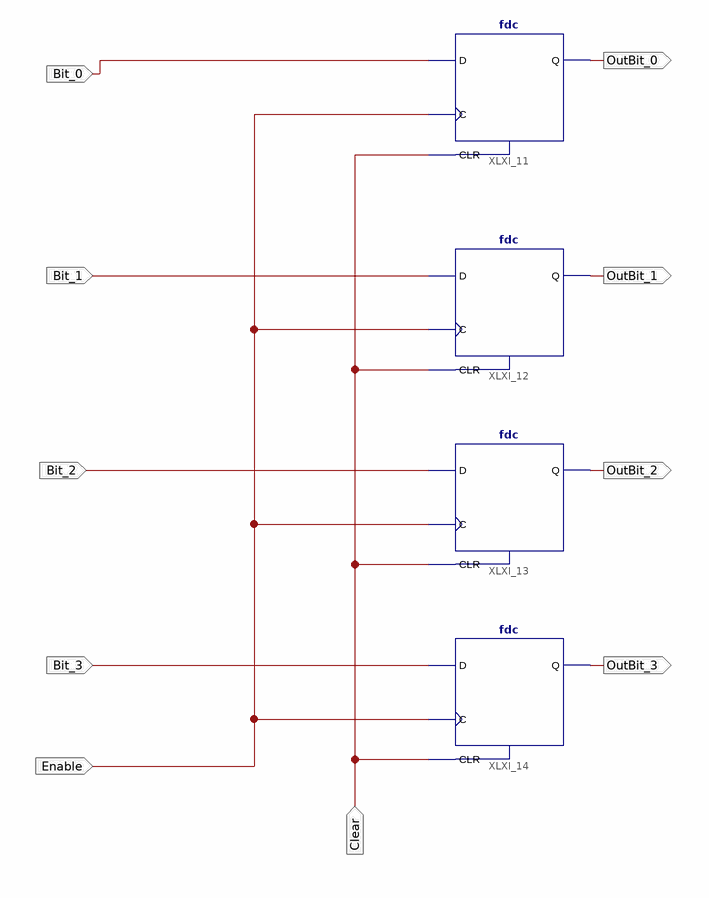
[diagram p0: schematic sheet 1]
// Xilinx ISE schematic FF_4bit.sch (spartan6) as structural Verilog: 4 symbols, 10 ports
module FF_4bit (
  input  Bit_0,
  input  Bit_1,
  input  Bit_2,
  input  Bit_3,
  input  Clear,
  input  Enable,
  output OutBit_1,
  output OutBit_2,
  output OutBit_3,
  output OutBit_0
);

  fdc XLXI_12 (.C(Enable), .CLR(Clear), .D(Bit_1), .Q(OutBit_1));
  fdc XLXI_13 (.C(Enable), .CLR(Clear), .D(Bit_2), .Q(OutBit_2));
  fdc XLXI_14 (.C(Enable), .CLR(Clear), .D(Bit_3), .Q(OutBit_3));
  fdc XLXI_11 (.C(Enable), .CLR(Clear), .D(Bit_0), .Q(OutBit_0));
endmodule
